# Altium schematic sheet Boost-V1.0.SchDoc
size A4
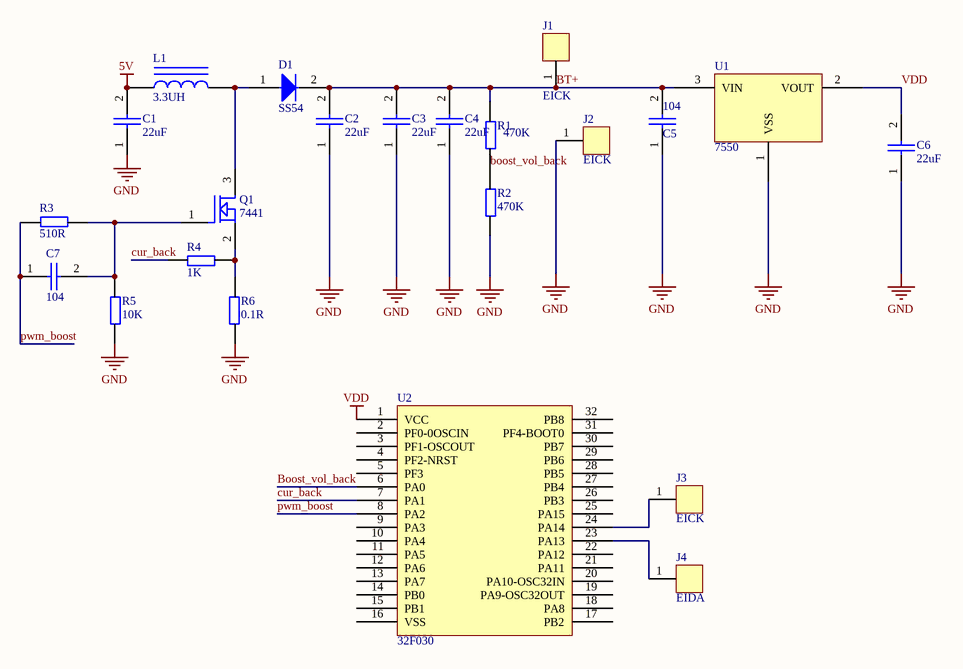
[diagram p0: Boost-V1.0.SchDoc]

## Parts
C1  22uF  [0805]
C2  22uF  [0805]
C3  22uF  [0805]
C4  22uF  [0805]
C5  104  [0603]
C6  22uF  [0805]
C7  104  [0603]
D1  SS54
J1  EICK  [PAD]
J2  EICK  [PAD]
J3  EICK  [PAD]
J4  EIDA  [PAD]
L1  3.3UH
Q1  7441  [SOT-89]
R1  470K  [0603]
R2  470K  [0603]
R3  510R  [0603]
R4  1K  [0603]
R5  10K  [0603]
R6  0.1R  [0603]
U1  7550  [SOT-89]
U2  32F030  [QFN32-5*5]

## Nets
5V: C1.2 L1.1
GND: C1.1 C2.1 C3.1 C4.1 C5.1 C6.1 J2.1 R2.1 R5.1 R6.2 U1.1(VSS)
VDD: C6.2 U1.2(VOUT) U2.1(VCC)
boost_vol_back: R1.1 R2.2 U2.6(PA0)
BT+: C2.2 C3.2 C4.2 C5.2 D1.2 J1.1 R1.2 U1.3(VIN)
cur_back: R4.1 U2.7(PA1)
pwm_boost: C7.1 R3.2 U2.8(PA2)
NetC7_2: C7.2 Q1.1 R3.1 R5.2
NetD1_1: D1.1 L1.2 Q1.3
NetJ3_1: J3.1 U2.24(PA14)
NetJ4_1: J4.1 U2.23(PA13)
NetQ1_2: Q1.2 R4.2 R6.1

Not connected (* = marked no-connect by the designer): U2 2(PF0-0OSCIN) 3(PF1-OSCOUT) 4(PF2-NRST) 5(PF3) 9(PA3) 10(PA4) 11(PA5) 12(PA6) 13(PA7) 14(PB0) 15(PB1) 16(VSS) 17(PB2) 18(PA8) 19(PA9-OSC32OUT) 20(PA10-OSC32IN) 21(PA11) 22(PA12) 25(PA15) 26(PB3) 27(PB4) 28(PB5) 29(PB6) 30(PB7) 31(PF4-BOOT0) 32(PB8)

## Library data of the parts
C1-C7 = CAP
D1 = DIODE
J1-J4 = CON1
L1 = INDUCTOF
Q1 = MOSFET N
R1-R6 = RES
U1 = 3508